# EAGLE design test (EAGLE 5.03)
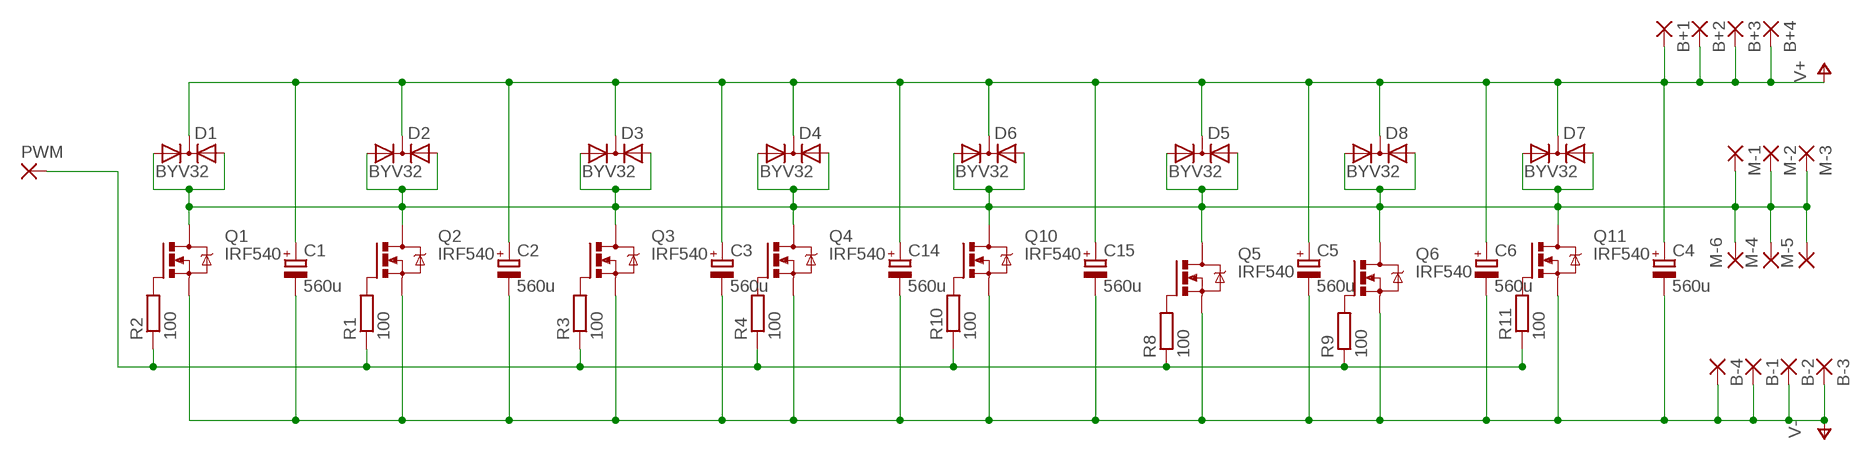
[diagram p0: schematic, sheet 1]

## Parts
B+1  3,81/1,4  [3,81/1,4]
B+2  3,81/1,4  [3,81/1,4]
B+3  3,81/1,4  [3,81/1,4]
B+4  3,81/1,4  [3,81/1,4]
B-1  3,81/1,4  [3,81/1,4]
B-2  3,81/1,4  [3,81/1,4]
B-3  3,81/1,4  [3,81/1,4]
B-4  3,81/1,4  [3,81/1,4]
C1  560u  CPOL-EUE10-22.5  [EB22,5D]
C2  560u  CPOL-EUE10-22.5  [EB22,5D]
C3  560u  CPOL-EUE10-22.5  [EB22,5D]
C4  560u  CPOL-EUE10-22.5  [EB22,5D]
C5  560u  CPOL-EUE10-22.5  [EB22,5D]
C6  560u  CPOL-EUE10-22.5  [EB22,5D]
C14  560u  CPOL-EUE10-22.5  [EB22,5D]
C15  560u  CPOL-EUE10-22.5  [EB22,5D]
D1  BYV32  [TO220ABS]
D2  BYV32  [TO220ABS]
D3  BYV32  [TO220ABS]
D4  BYV32  [TO220ABS]
D5  BYV32  [TO220ABS]
D6  BYV32  [TO220ABS]
D7  BYV32  [TO220ABS]
D8  BYV32  [TO220ABS]
M-1  3,81/1,4  [3,81/1,4]
M-2  3,81/1,4  [3,81/1,4]
M-3  3,81/1,4  [3,81/1,4]
M-4  3,81/1,4  [3,81/1,4]
M-5  3,81/1,4  [3,81/1,4]
M-6  3,81/1,4  [3,81/1,4]
PWM  3,81/1,4  [3,81/1,4]
Q1  IRF540  [TO220BV]
Q2  IRF540  [TO220BV]
Q3  IRF540  [TO220BV]
Q4  IRF540  [TO220BV]
Q5  IRF540  [TO220BV]
Q6  IRF540  [TO220BV]
Q10  IRF540  [TO220BV]
Q11  IRF540  [TO220BV]
R1  100  R-EU_0207/10  [0207/10]
R2  100  R-EU_0207/10  [0207/10]
R3  100  R-EU_0207/10  [0207/10]
R4  100  R-EU_0207/10  [0207/10]
R8  100  R-EU_0207/10  [0207/10]
R9  100  R-EU_0207/10  [0207/10]
R10  100  R-EU_0207/10  [0207/10]
R11  100  R-EU_0207/10  [0207/10]

## Nets
M-: D1.A1 D1.A2 D2.A1 D2.A2 D3.A1 D3.A2 D4.A1 D4.A2 D5.A1 D5.A2 D6.A1 D6.A2 D7.A1 D7.A2 D8.A1 D8.A2 M-1.1(P) M-2.1(P) M-3.1(P) M-4.1(P) M-5.1(P) M-6.1(P) Q1.D Q2.D Q3.D Q4.D Q5.D Q6.D Q10.D Q11.D
N$1: Q10.G R10.2
N$4: Q5.G R8.2
N$5: Q6.G R9.2
N$7: Q2.G R1.2
N$8: Q1.G R2.2
N$9: Q3.G R3.2
N$10: Q4.G R4.2
N$11: PWM.1(P) R1.1 R2.1 R3.1 R4.1 R8.1 R9.1 R10.1 R11.1
N$18: Q11.G R11.2
V+: B+1.1(P) B+2.1(P) B+3.1(P) B+4.1(P) C1.+ C2.+ C3.+ C4.+ C5.+ C6.+ C14.+ C15.+ D1.C D2.C D3.C D4.C D5.C D6.C D7.C D8.C
V-: B-1.1(P) B-2.1(P) B-3.1(P) B-4.1(P) C1.- C2.- C3.- C4.- C5.- C6.- C14.- C15.- Q1.S Q2.S Q3.S Q4.S Q5.S Q6.S Q10.S Q11.S

## Library data of the parts
B+1-B+4 B-1-B-4 M-1-M-6 PWM = wirepad:3,81/1,4: THROUGH-HOLE PAD
C1-C6 C14 C15 = rcl:CPOL-EU: POLARIZED CAPACITOR, European symbol
D1-D8 = diode:BYV32: DIODE 2 x Si diode 200 V, 20 A/230 Apeak, 25 ns
Q1-Q6 Q10 Q11 = transistor-power:IRF540: HEXFET Power MOSFET
R1-R4 R8-R11 = rcl:R-EU_: RESISTOR, European symbol

## Board
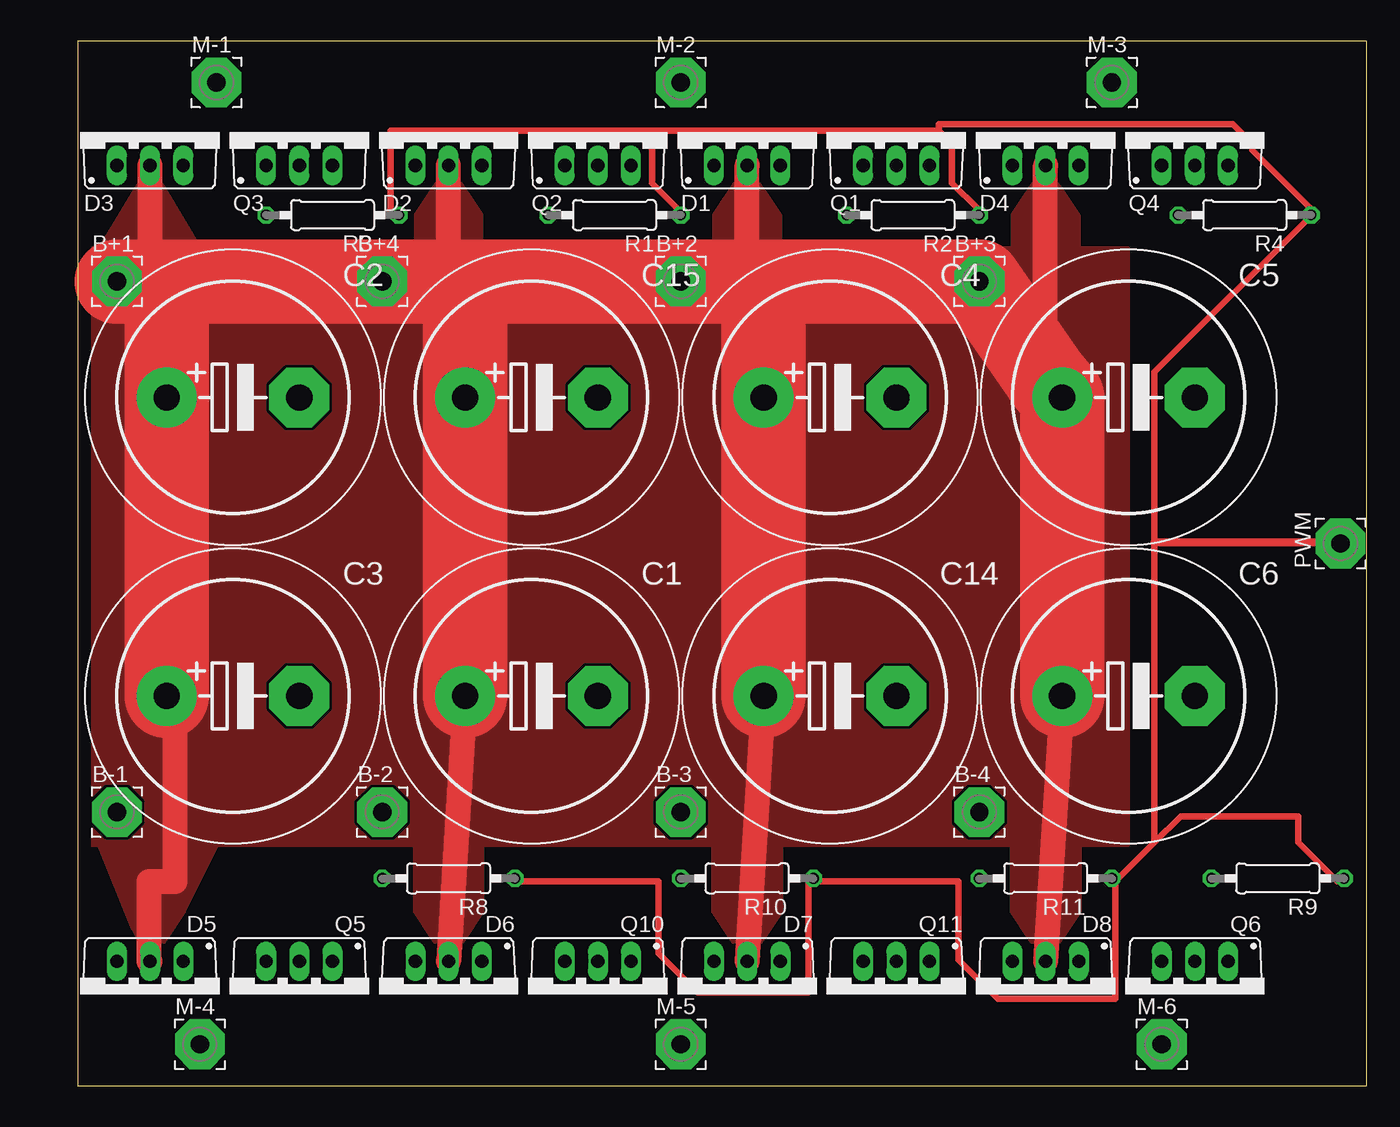
[diagram p1: board, top side]
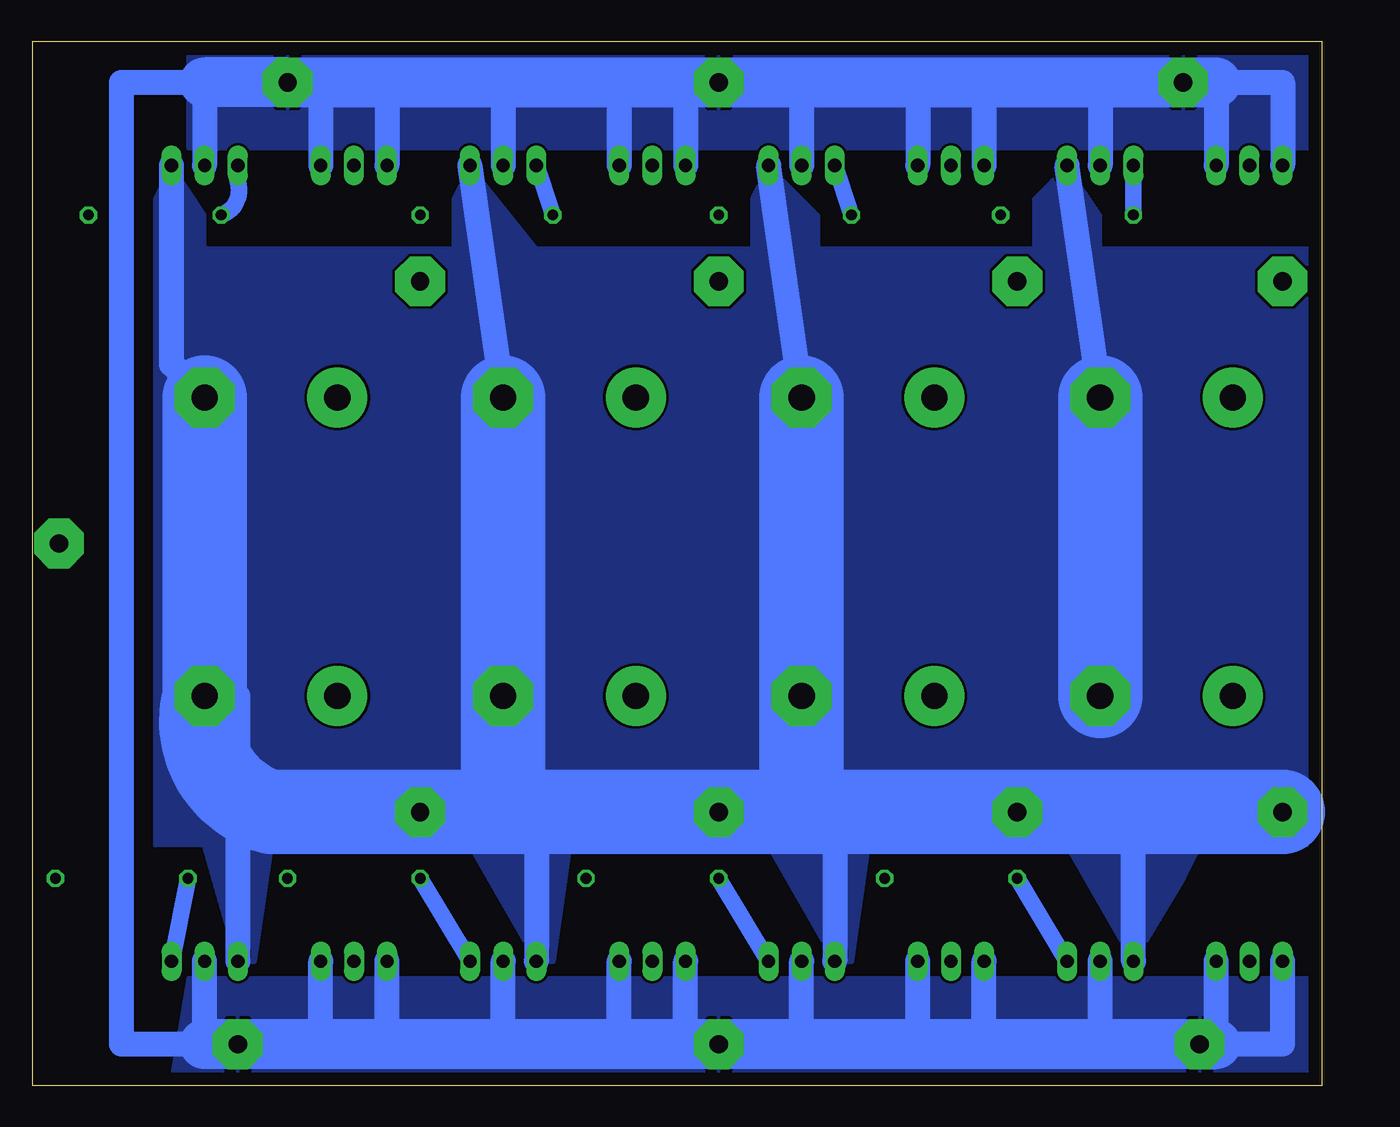
[diagram p2: board, bottom side, seen from below]

Size 98.73 x 80 mm. Coordinates in mm from the lower left corner, seen from the top.
Outline: 0,0 98.73,0 98.73,80 0,80 0,0
Copper layers (1*16): Top 0.035mm / dielectric 1.5mm / Bottom 0.035mm
Design rules "default": minimum track width 10mil, minimum drill 24mil, track to track 8mil, track to pad 0.5mm, pad to pad 1mm, via to via 1mm, smd to smd 8mil, copper to edge 40mil, drill to drill 8mil, minimum pad ring 10mil, minimum via ring 8mil, stop-mask expansion 2mm, vias tented up to drill 0mil, thermal gap 10mil

### Footprints (pad centres in the part's own frame; a part is rotated, then mirrored left to right if it is on the bottom)
3,81/1,4 = drill 1.397 pad 3.81 octagon: 1 0,0
EB22,5D = drill 2.007 pad 4.597 round: + -5.08,0 | drill 2.007 pad 4.597 octagon: - 5.08,0
TO220ABS = drill 1.016 long: A1 -2.54,-2.54; A2 2.54,-2.54; C 0,-2.54
TO220BV = drill 1.016 long: D 0,-2.54; G -2.54,-2.54; S 2.54,-2.54
0207/10 = drill 0.813 octagon: 1 -5.08,0; 2 5.08,0

### Placement (x,y rotation side)
B+1  3.01,61.59 0 top
B+2  46.19,61.59 0 top
B+3  69.05,61.59 0 top
B+4  23.33,61.59 0 top
B-1  3.01,20.95 0 top
B-2  23.33,20.95 0 top
B-3  46.19,20.95 0 top
B-4  69.05,20.95 0 top
C1  34.76,29.84 0 top
C2  11.9,52.7 0 top
C3  11.9,29.84 0 top
C4  57.62,52.7 0 top
C5  80.48,52.7 0 top
C6  80.48,29.84 0 top
C14  57.62,29.84 0 top
C15  34.76,52.7 0 top
D1  51.27,73.02 0 top
D2  28.41,73.02 0 top
D3  5.55,73.02 0 top
D4  74.13,73.02 0 top
D5  5.55,6.98 180 top
D6  28.41,6.98 180 top
D7  51.27,6.98 180 top
D8  74.13,6.98 180 top
M-1  10.63,76.83 0 top
M-2  46.19,76.83 0 top
M-3  79.21,76.83 0 top
M-4  9.36,3.17 0 top
M-5  46.19,3.17 0 top
M-6  83.02,3.17 0 top
PWM  96.72,41.52 90 top
Q1  62.7,73.02 0 top
Q2  39.84,73.02 0 top
Q3  16.98,73.02 0 top
Q4  85.56,73.02 0 top
Q5  16.98,6.98 180 top
Q6  85.56,6.98 180 top
Q10  39.84,6.98 180 top
Q11  62.7,6.98 180 top
R1  41.11,66.67 180 top
R2  63.97,66.67 180 top
R3  19.52,66.67 180 top
R4  89.37,66.67 180 top
R8  28.41,15.87 180 top
R9  91.91,15.87 180 top
R10  51.27,15.87 180 top
R11  74.13,15.87 180 top

### Tracks (layer width: path | path; a pad name or v marks a point on that pad's centre or on a via)
M-
  Bottom 1.93: 25.87,3.17 D6.A2 | 48.73,3.17 D7.A2 | 71.59,3.17 D8.A2 | 8.09,3.17 D5.A1 | 30.95,3.17 D6.A1 | 53.81,3.17 D7.A1 | 76.67,3.17 D8.A1 | 16.98,3.17 Q5.D | 39.84,3.17 Q10.D | 62.7,3.17 Q11.D | 8.09,76.83 D3.A2 | 25.87,76.83 D2.A1 | 30.95,76.83 D2.A2 | 48.73,76.83 D1.A1 | 53.81,76.83 D1.A2 | 71.59,76.83 D4.A1 | 76.67,76.83 D4.A2 | 85.56,76.83 Q4.D | 62.7,76.83 Q1.D | 39.84,76.83 Q2.D | 16.98,76.83 Q3.D | 85.56,3.17 Q6.D | M-1.1 3.01,76.83 D3.A1 | M-6.1 91.91,3.17 91.91,76.83 M-3.1 | D5.A2 3.01,3.17 M-4.1
  Bottom 3.81: 85.56,3.17 M-6.1 76.67,3.17 71.59,3.17 62.7,3.17 53.81,3.17 48.73,3.17 M-5.1 39.84,3.17 30.95,3.17 25.87,3.17 16.98,3.17 M-4.1 8.09,3.17 | 85.56,76.83 M-3.1 76.67,76.83 71.59,76.83 62.7,76.83 53.81,76.83 48.73,76.83 M-2.1 39.84,76.83 30.95,76.83 25.87,76.83 16.98,76.83 M-1.1 8.09,76.83
  pour Bottom: 0.47,0.63 0.47,8.25 86.83,8.25 88.1,0.63
  pour Bottom: 0.47,71.75 86.83,71.75 86.83,79.37 0.47,79.37
N$1
  Bottom 1.27: Q10.G R10.2
N$4
  Bottom 1.27: Q5.G R8.2
N$5
  Bottom 1.27: Q6.G R9.2
N$7
  Bottom 1.27: R1.2 Q2.G
N$8
  Bottom 1.27: R2.2 Q1.G
N$9
  Bottom 1.27: R3.2 Q3.G
N$10
  Bottom 1.27: Q4.G 83.02,69.21 arc90 R4.2
N$11
  Top 0.508: 82.47,18.63 84.47,20.63 93.47,20.63 93.47,18.63 96.47,15.63 R9.1 | 79.47,15.63 82.47,18.63 | 82.47,18.63 82.47,41.63 82.47,54.63 94.47,66.63 R4.1 94.47,67.13 89.97,71.63 89.97,72.13 88.47,73.63 65.97,73.63 65.97,73.13 | 79.47,15.63 79.47,6.63 70.47,6.63 67.47,9.63 67.47,15.63 56.47,15.63 R10.1 55.97,15.63 55.97,7.13 47.47,7.13 44.47,10.13 44.47,15.63 33.97,15.63 R8.1 | 79.47,15.63 R11.1 | 42.97,73.13 43.97,72.13 43.97,69.13 45.97,67.13 R1.1 | 42.97,73.13 23.97,73.13 23.97,66.63 R3.1 | 65.97,73.13 66.97,72.13 66.97,69.13 68.97,67.13 R2.1 | 65.97,73.13 42.97,73.13
  Top 0.61: 82.47,41.63 94.97,41.63 PWM.1
N$18
  Bottom 1.27: Q11.G R11.2
V+
  Top 1.93: C6.+ D8.C | C14.+ D7.C | C1.+ D6.C | 5.55,61.59 D3.C | 28.41,61.59 D2.C | 51.27,61.59 D1.C | 74.25,54.07 74.13,53.97 D4.C | D5.C 5.47,9.52 5.47,15.63 7.47,15.63 7.47,29.63 6.47,29.63 6.47,29.84 C3.+
  Top 6.452: C3.+ C2.+ 6.82,61.59 | C1.+ C15.+ 29.68,61.59 | C14.+ C4.+ 52.54,61.59 | C6.+ C5.+ 74.25,54.07 B+3.1 52.54,61.59 | 6.82,61.59 5.55,61.59 B+1.1 | 6.82,61.59 B+4.1 28.41,61.59 29.68,61.59 | 29.68,61.59 B+2.1 51.27,61.59 52.54,61.59
  pour Top: 0.47,64.13 0.47,18.41 80.48,18.41 80.48,64.13
  pour Top: 8.09,13.33 10.63,18.41 1.74,18.41 4.28,12.06 5.55,9.52
  pour Top: 28.41,9.52 25.87,13.33 25.87,19.68 30.95,19.68 30.95,13.33
  pour Top: 51.27,9.52 48.73,13.33 48.73,18.41 50,19.68 53.81,19.68 53.81,13.33
  pour Top: 74.13,9.52 71.59,13.33 71.59,18.41 76.67,18.41 76.67,13.33
  pour Top: 5.55,70.48 1.74,64.13 9.36,64.13
  pour Top: 28.41,70.48 30.95,66.67 30.95,64.13 25.87,64.13 25.87,66.67
  pour Top: 51.27,70.48 48.73,66.67 48.73,62.86 53.81,62.86 53.81,66.67
  pour Top: 74.13,70.48 71.59,66.67 71.59,64.13 76.67,64.13 76.67,66.67
V-
  Bottom 1.93: Q5.S 14.44,20.95 | 37.3,20.95 Q10.S | 60.16,20.95 Q11.S | Q6.S 83.02,29.84 C6.- | C4.- Q1.S | C15.- Q2.S | C2.- Q3.S | Q4.S 88.1,55.24 C5.-
  Bottom 6.452: C5.- C6.- arc-90 80.48,20.95 B-4.1 62.7,20.95 | C4.- C14.- 62.7,20.95 | C15.- C1.- 39.84,20.95 | C3.- C2.- | B-1.1 14.44,20.95 B-2.1 37.3,20.95 39.84,20.95 | 39.84,20.95 B-3.1 60.16,20.95 62.7,20.95
  pour Bottom: 0.47,64.13 0.47,18.41 89.37,18.41 89.37,64.13
  pour Bottom: 14.44,9.52 10.63,15.87 9.36,18.41 19.52,18.41
  pour Bottom: 37.3,9.52 36.03,9.52 34.76,18.41 39.84,18.41 41.11,18.41 42.38,18.41
  pour Bottom: 60.16,9.52 58.89,9.52 57.62,18.41 63.97,18.41 65.24,18.41
  pour Bottom: 83.02,9.52 81.75,9.52 80.48,18.41 85.56,18.41
  pour Bottom: 19.52,70.48 16.98,66.67 16.98,64.13 22.06,64.13 22.06,67.94
  pour Bottom: 42.38,70.48 38.57,66.67 38.57,64.13 43.65,64.13 43.65,67.94
  pour Bottom: 65.24,70.48 60.16,64.13 66.51,64.13 66.51,67.94
  pour Bottom: 88.1,70.48 89.37,67.94 89.37,64.13 86.83,64.13 85.56,64.13 85.56,66.67